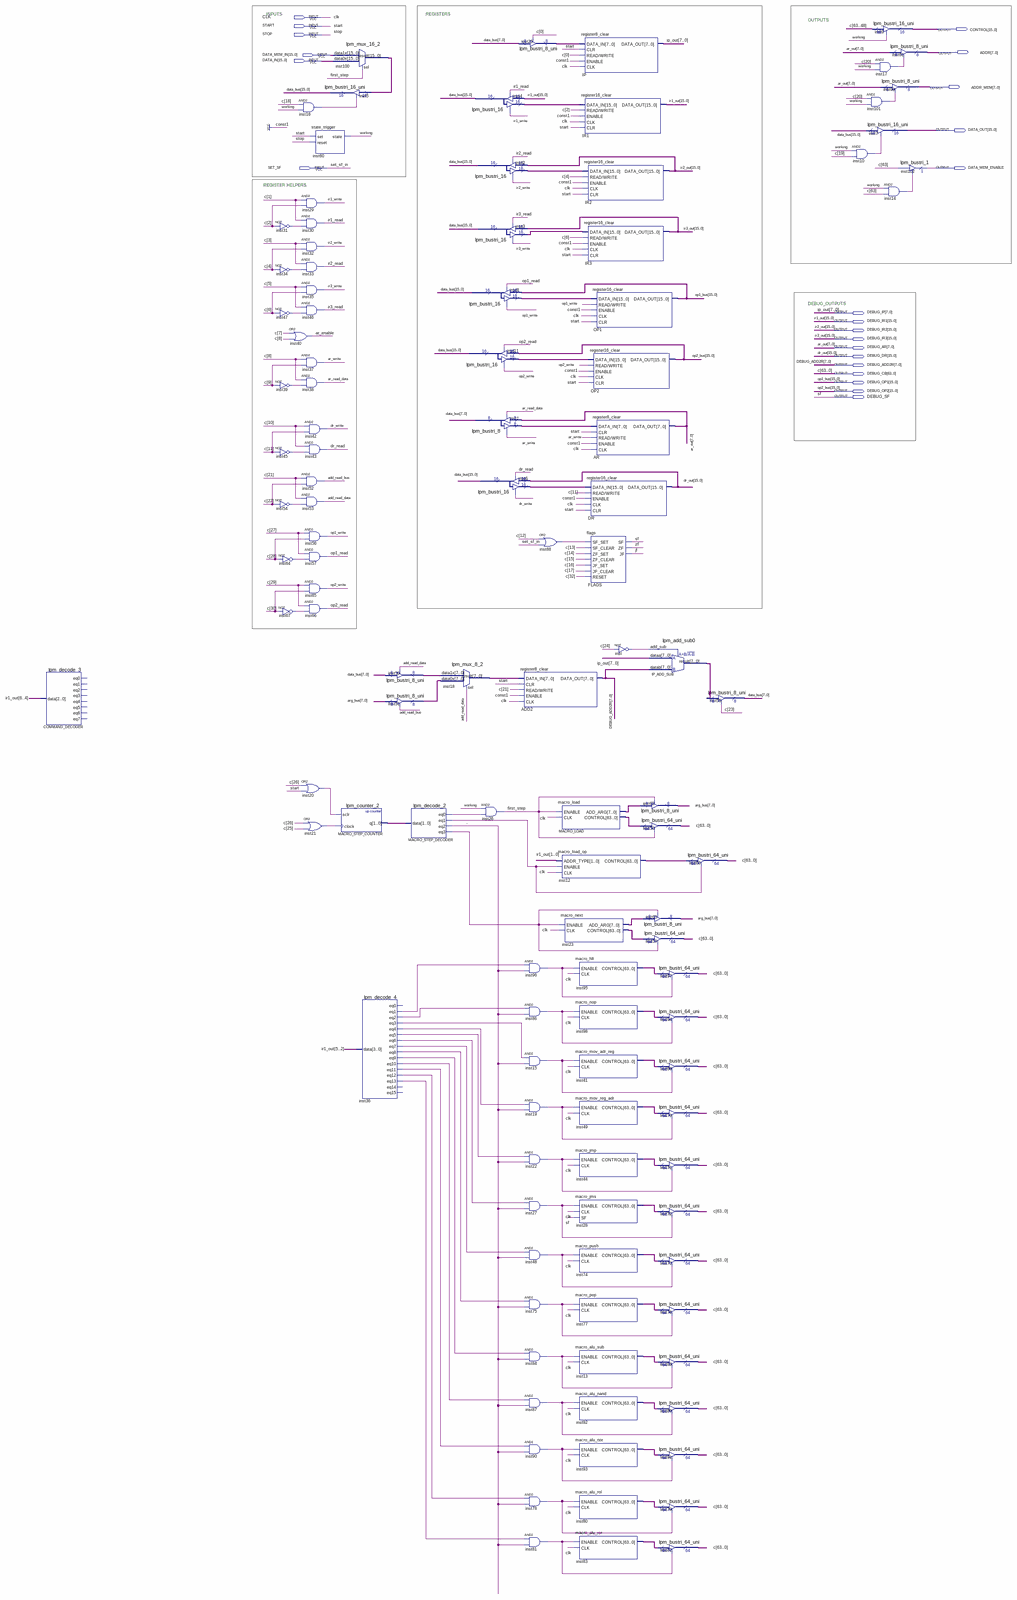
[diagram p0: schematic sheet, whole]
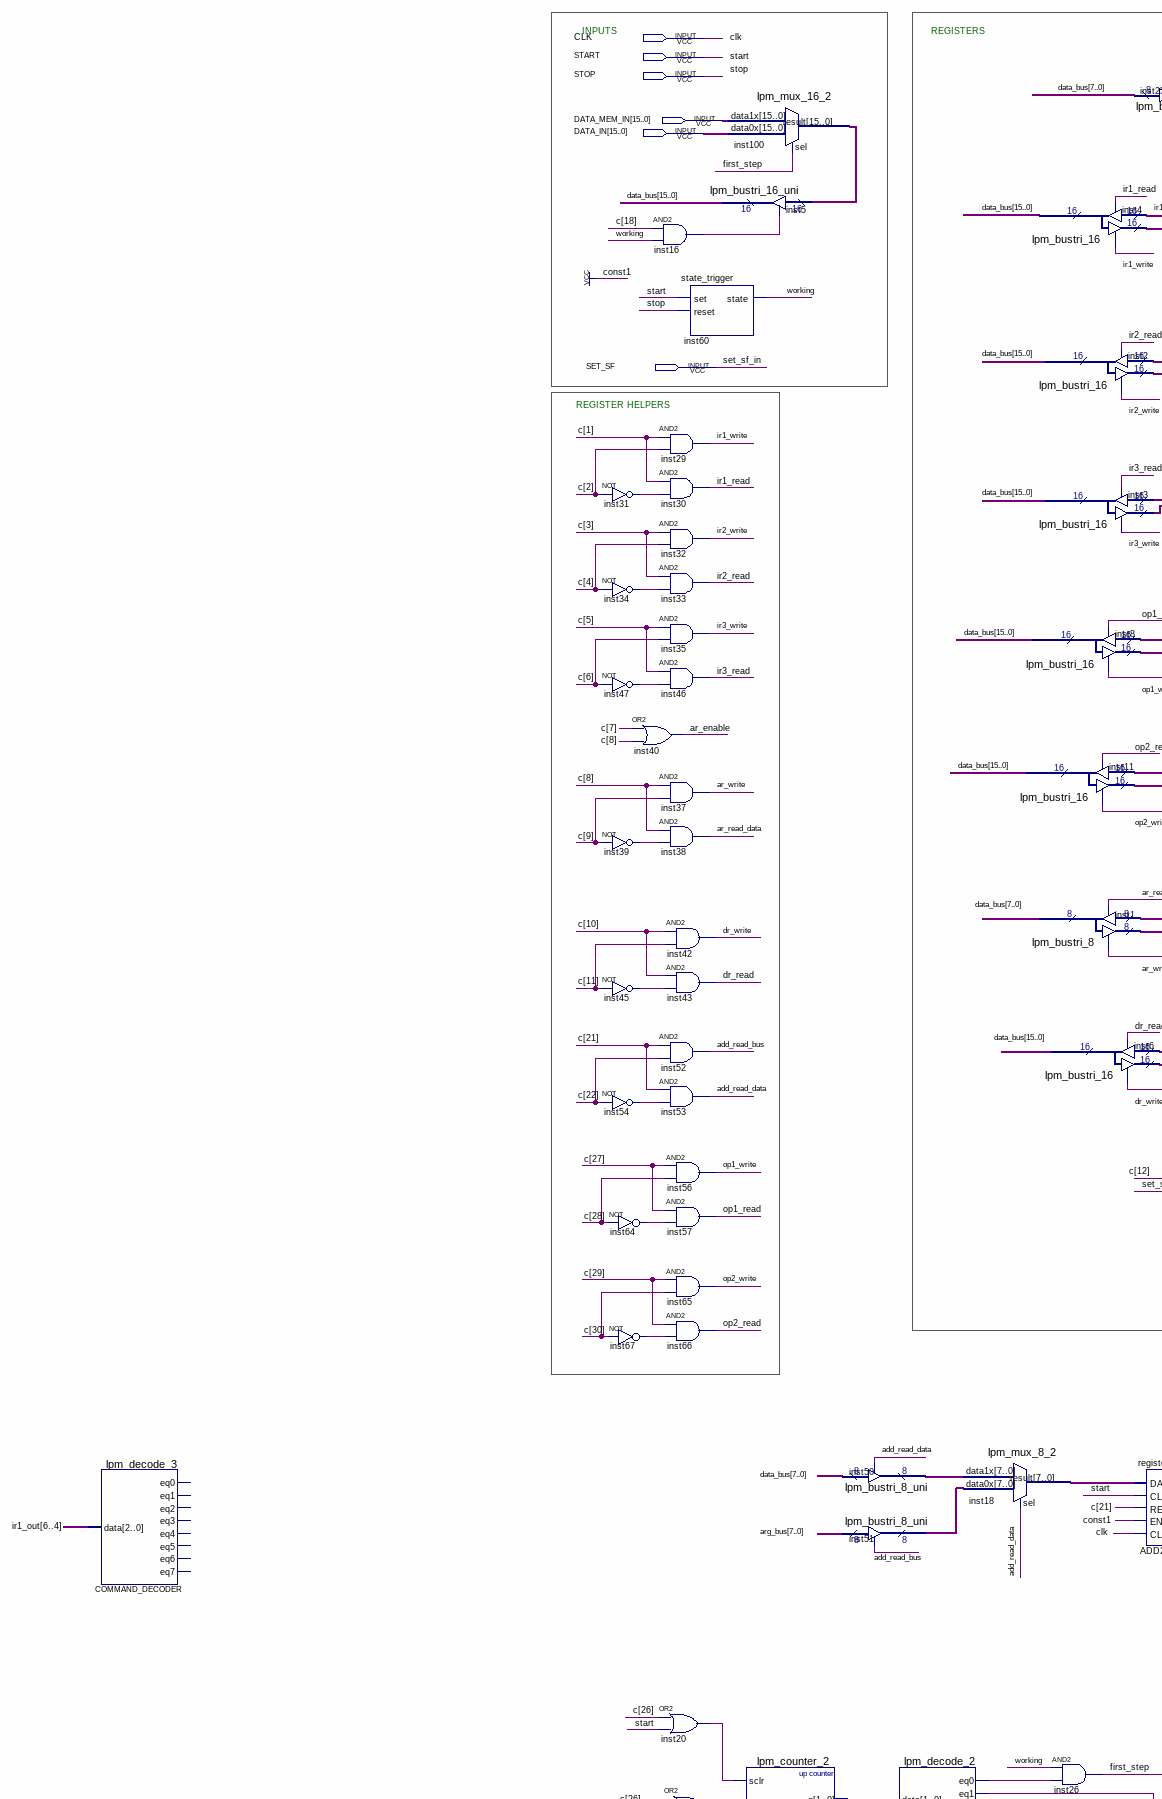
[diagram p1: schematic sheet, upper left part]
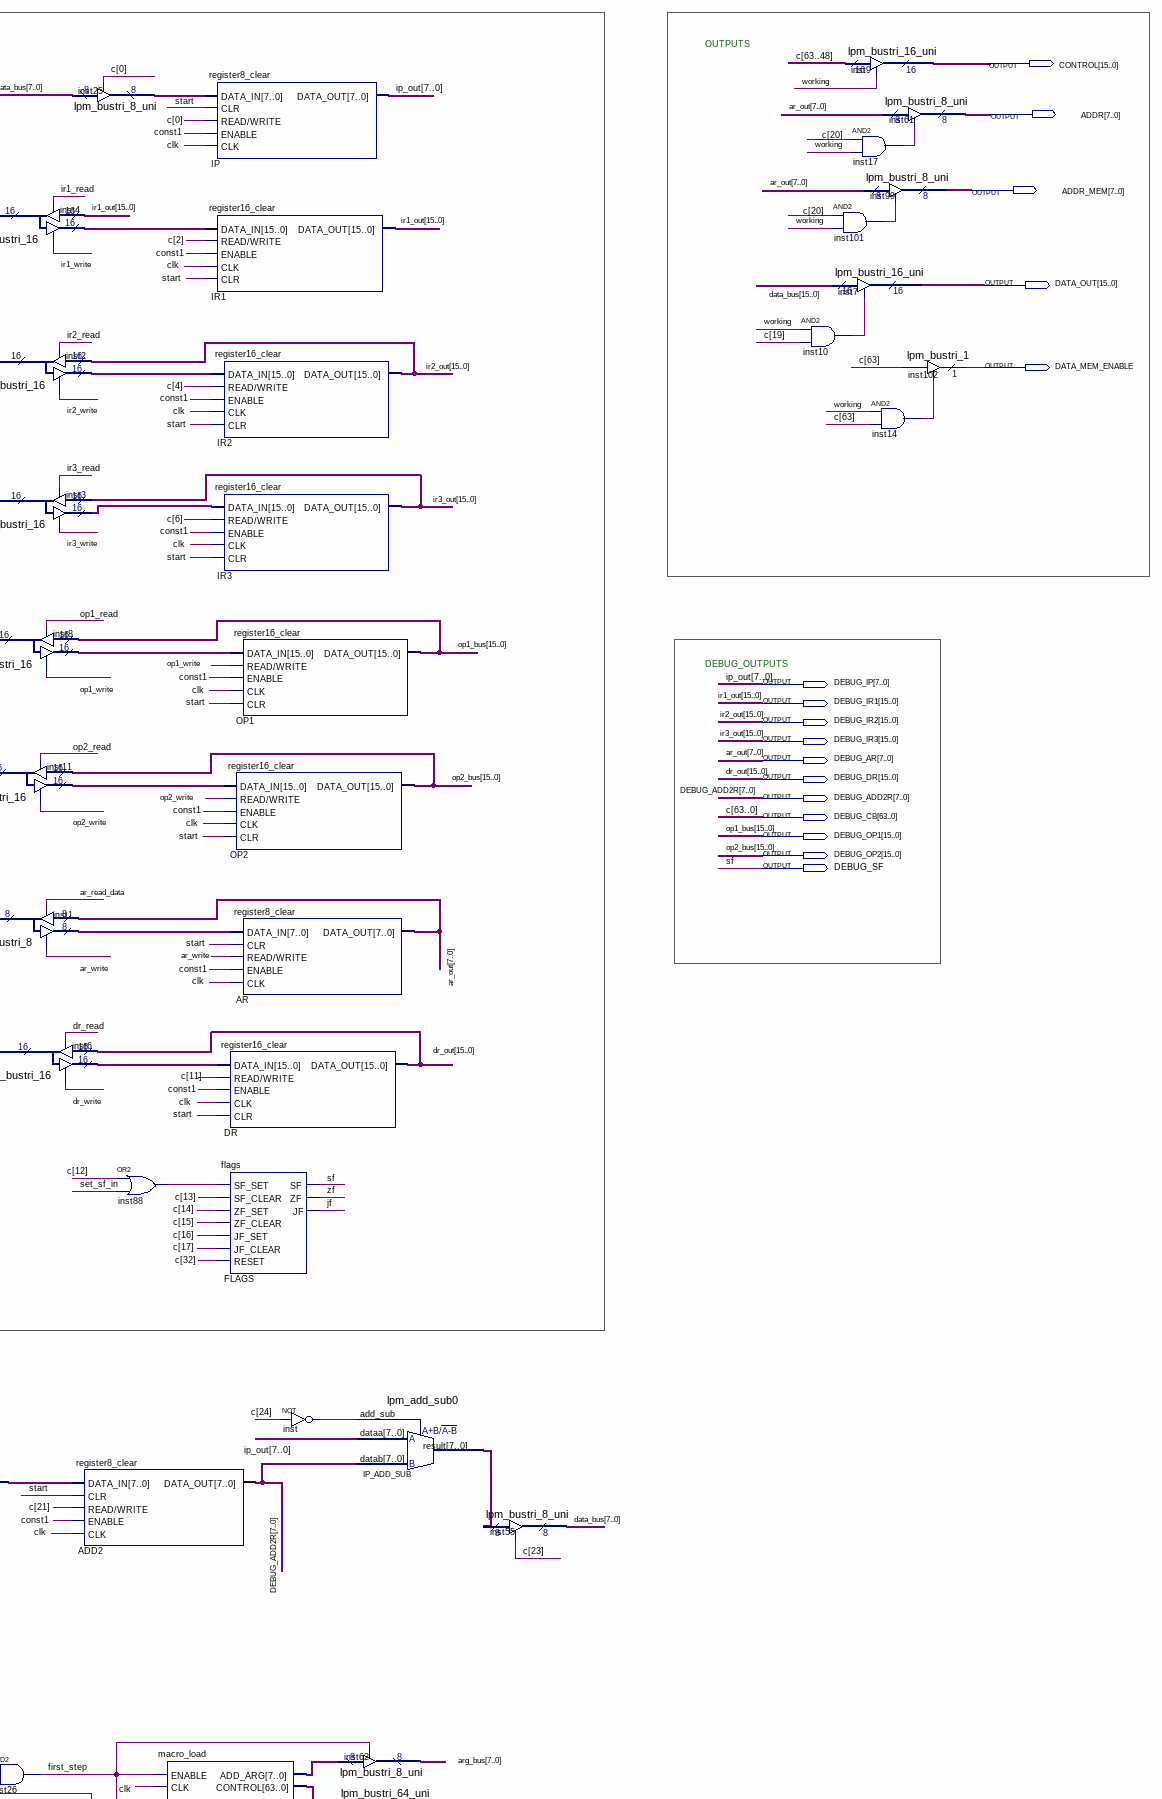
[diagram p2: schematic sheet, upper right part]
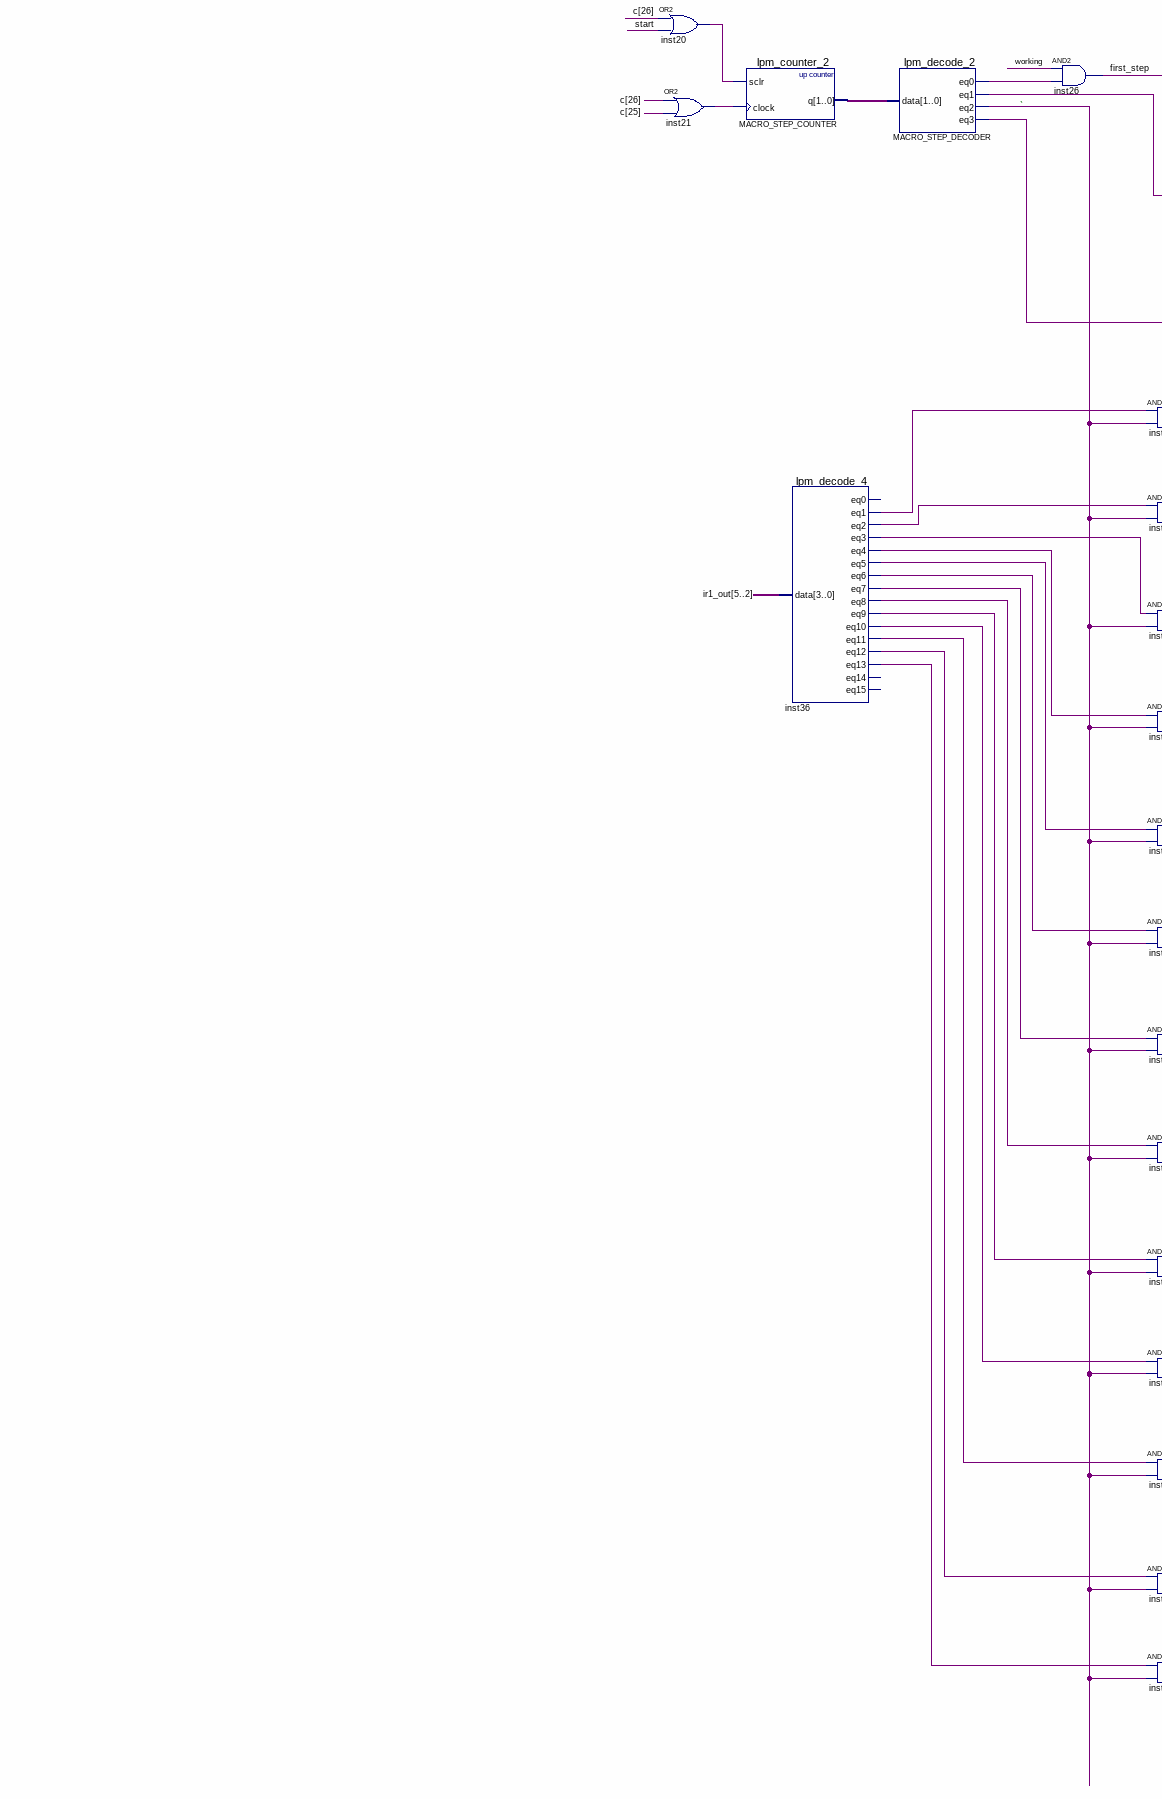
[diagram p3: schematic sheet, lower left part]
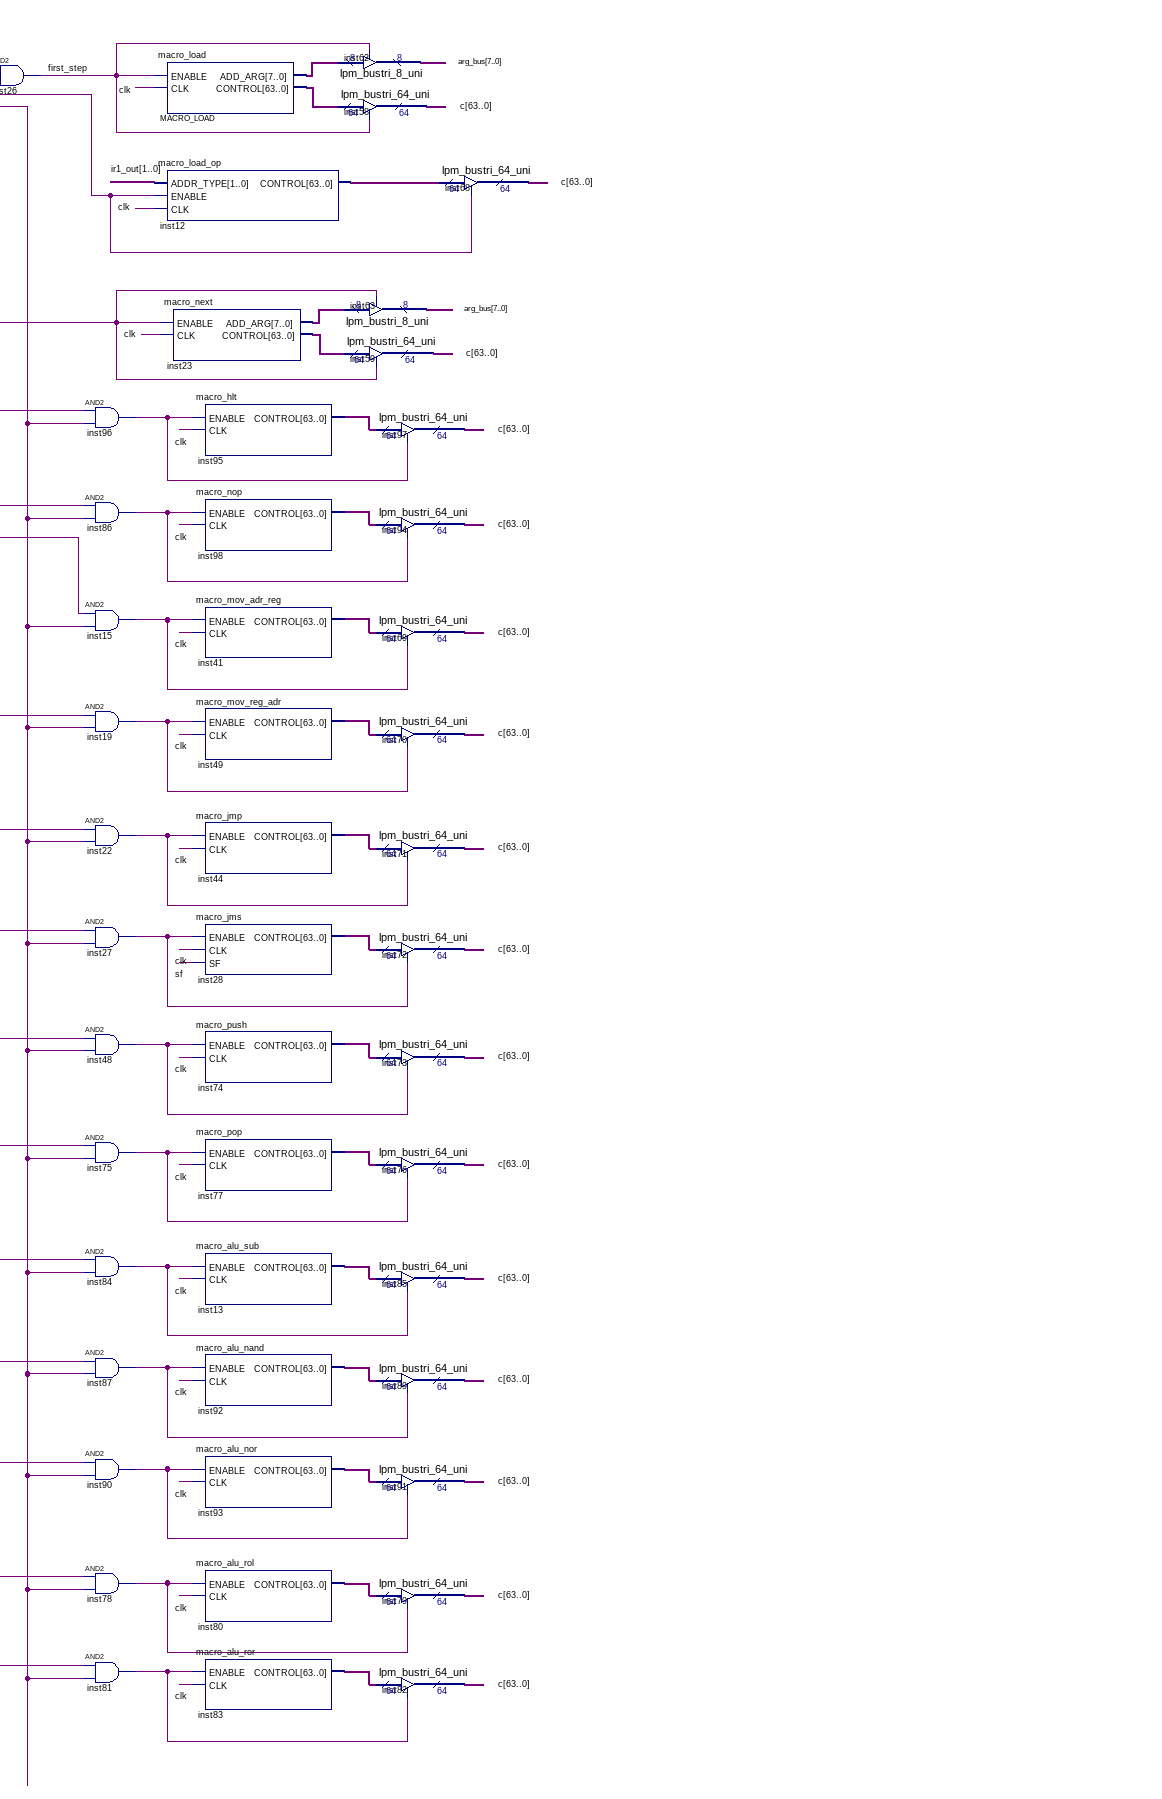
[diagram p4: schematic sheet, lower right part]
// Quartus schematic control_block.bdf as structural Verilog: 117 symbols, 22 pins
module control_block (
  input  CLK,
  input  START,
  input  STOP,
  input  [15:0] DATA_MEM_IN,
  input  [15:0] DATA_IN,
  input  SET_SF,
  output [15:0] CONTROL,
  output [7:0] ADDR,
  output [7:0] ADDR_MEM,
  output [15:0] DATA_OUT,
  output DATA_MEM_ENABLE,
  output [7:0] DEBUG_IP,
  output [15:0] DEBUG_IR1,
  output [15:0] DEBUG_IR2,
  output [15:0] DEBUG_IR3,
  output [7:0] DEBUG_AR,
  output [15:0] DEBUG_DR,
  output [7:0] DEBUG_ADD2R,
  output [63:0] DEBUG_CB,
  output [15:0] DEBUG_OP1,
  output [15:0] DEBUG_OP2,
  output DEBUG_SF
);

  wire add_read_bus, add_read_data, ar_enable, ar_read_data, ar_write, dr_read, dr_write, first_step,
       inst10_out, inst14_out, inst15_out, inst16_out, inst17_out, inst19_out, inst20_out, inst21_out,
       inst22_out, inst27_out, inst31_out, inst34_out, inst36_eq1, inst36_eq2, inst36_eq3, inst36_eq4,
       inst36_eq5, inst36_eq6, inst36_eq7, inst36_eq8, inst36_eq9, inst36_eq10, inst36_eq11, inst36_eq12,
       inst36_eq13, inst39_out, inst45_out, inst47_out, inst48_out, inst54_out, inst64_out, inst67_out,
       inst75_out, inst78_out, inst81_out, inst84_out, inst86_out, inst87_out, inst88_out, inst90_out,
       inst96_out, inst101_out, inst_out, ir1_read, ir1_write, ir2_read, ir2_write, ir3_read, ir3_write, jf,
       MACRO_STEP_DECODER_eq0, MACRO_STEP_DECODER_eq1, MACRO_STEP_DECODER_eq2, MACRO_STEP_DECODER_eq3,
       op1_read, op1_write, op2_read, op2_write, working, zf;
  wire [1:0] MACRO_STEP_COUNTER_q;
  wire [7:0] arg_bus, inst1_result, inst18_result, inst23_add_arg, inst25_tridata, inst50_tridata,
       inst51_tridata, IP_ADD_SUB_result, MACRO_LOAD_add_arg;
  wire [15:0] data_bus, inst2_result, inst3_result, inst4_result, inst6_result, inst8_result, inst11_result,
       inst100_result;
  wire [63:0] inst12_control, inst13_control, inst23_control, inst28_control, inst41_control, inst44_control,
       inst49_control, inst74_control, inst77_control, inst80_control, inst83_control, inst92_control,
       inst93_control, inst95_control, inst98_control, MACRO_LOAD_control;

  lpm_decode_3 COMMAND_DECODER (.data(DEBUG_IR1[6:4]));  // open: eq0, eq1, eq2, eq3, eq4, eq5, eq6, eq7
  not inst31 (inst31_out, DEBUG_CB[2]);
  not inst34 (inst34_out, DEBUG_CB[4]);
  not inst47 (inst47_out, DEBUG_CB[6]);
  or inst40 (ar_enable, DEBUG_CB[7], DEBUG_CB[8]);
  not inst39 (inst39_out, DEBUG_CB[9]);
  not inst45 (inst45_out, DEBUG_CB[11]);
  not inst54 (inst54_out, DEBUG_CB[22]);
  not inst64 (inst64_out, DEBUG_CB[28]);
  not inst67 (inst67_out, DEBUG_CB[30]);
  and inst16 (inst16_out, DEBUG_CB[18], working);
  state_trigger inst60 (.set(START), .reset(STOP), .state(working));
  and inst29 (ir1_write, DEBUG_CB[1], DEBUG_CB[2]);
  and inst30 (ir1_read, DEBUG_CB[1], inst31_out);
  and inst32 (ir2_write, DEBUG_CB[3], DEBUG_CB[4]);
  and inst33 (ir2_read, DEBUG_CB[3], inst34_out);
  and inst35 (ir3_write, DEBUG_CB[5], DEBUG_CB[6]);
  and inst46 (ir3_read, DEBUG_CB[5], inst47_out);
  and inst37 (ar_write, DEBUG_CB[8], DEBUG_CB[9]);
  and inst38 (ar_read_data, DEBUG_CB[8], inst39_out);
  and inst42 (dr_write, DEBUG_CB[10], DEBUG_CB[11]);
  and inst43 (dr_read, DEBUG_CB[10], inst45_out);
  and inst52 (add_read_bus, DEBUG_CB[21], DEBUG_CB[22]);
  and inst53 (add_read_data, DEBUG_CB[21], inst54_out);
  and inst56 (op1_write, DEBUG_CB[27], DEBUG_CB[28]);
  and inst57 (op1_read, DEBUG_CB[27], inst64_out);
  and inst65 (op2_write, DEBUG_CB[29], DEBUG_CB[30]);
  and inst66 (op2_read, DEBUG_CB[29], inst67_out);
  or inst20 (inst20_out, DEBUG_CB[26], START);
  or inst21 (inst21_out, DEBUG_CB[26], DEBUG_CB[25]);
  lpm_mux_16_2 inst100 (.data1x(DATA_MEM_IN), .data0x(DATA_IN), .sel(first_step), .result(inst100_result));
  lpm_bustri_16_uni inst5 (.enabledt(inst16_out), .data(inst100_result), .tridata(data_bus));
  lpm_counter_2 MACRO_STEP_COUNTER (.sclr(inst20_out), .clock(inst21_out), .q(MACRO_STEP_COUNTER_q));
  lpm_decode_4 inst36 (
    .data(DEBUG_IR1[5:2]), .eq1(inst36_eq1), .eq2(inst36_eq2), .eq3(inst36_eq3), .eq4(inst36_eq4),
    .eq5(inst36_eq5), .eq6(inst36_eq6), .eq7(inst36_eq7), .eq8(inst36_eq8), .eq9(inst36_eq9),
    .eq10(inst36_eq10), .eq11(inst36_eq11), .eq12(inst36_eq12), .eq13(inst36_eq13));  // open: eq0, eq14, eq15
  lpm_bustri_8_uni inst50 (.enabledt(add_read_data), .data(data_bus[7:0]), .tridata(inst50_tridata));
  lpm_bustri_8_uni inst51 (.enabledt(add_read_bus), .data(arg_bus), .tridata(inst51_tridata));
  lpm_decode_2 MACRO_STEP_DECODER (
    .data(MACRO_STEP_COUNTER_q), .eq0(MACRO_STEP_DECODER_eq0), .eq1(MACRO_STEP_DECODER_eq1),
    .eq2(MACRO_STEP_DECODER_eq2), .eq3(MACRO_STEP_DECODER_eq3));
  lpm_mux_8_2 inst18 (.data1x(inst50_tridata), .data0x(inst51_tridata), .sel(add_read_data), .result(inst18_result));
  lpm_bustri_16 inst4 (
    .enabledt(ir1_read), .data(DEBUG_IR1), .enabletr(ir1_write), .result(inst4_result), .tridata(data_bus));
  lpm_bustri_16 inst2 (
    .enabledt(ir2_read), .data(DEBUG_IR2), .enabletr(ir2_write), .result(inst2_result), .tridata(data_bus));
  lpm_bustri_16 inst3 (
    .enabledt(ir3_read), .data(DEBUG_IR3), .enabletr(ir3_write), .result(inst3_result), .tridata(data_bus));
  lpm_bustri_16 inst8 (
    .enabledt(op1_read), .data(DEBUG_OP1), .enabletr(op1_write), .result(inst8_result), .tridata(data_bus));
  lpm_bustri_16 inst11 (
    .enabledt(op2_read), .data(DEBUG_OP2), .enabletr(op2_write), .result(inst11_result), .tridata(data_bus));
  lpm_bustri_8 inst1 (
    .enabledt(ar_read_data), .data(DEBUG_AR), .enabletr(ar_write), .result(inst1_result),
    .tridata(data_bus[7:0]));
  lpm_bustri_16 inst6 (
    .enabledt(dr_read), .data(DEBUG_DR), .enabletr(dr_write), .result(inst6_result), .tridata(data_bus));
  and inst26 (first_step, working, MACRO_STEP_DECODER_eq0);
  lpm_bustri_8_uni inst25 (.enabledt(DEBUG_CB[0]), .data(data_bus[7:0]), .tridata(inst25_tridata));
  register8_clear ADD2 (
    .DATA_IN(inst18_result), .CLR(START), .\READ/WRITE (DEBUG_CB[21]), .ENABLE(1'b1), .CLK(CLK),
    .DATA_OUT(DEBUG_ADD2R));
  and inst96 (inst96_out, inst36_eq1, MACRO_STEP_DECODER_eq2);
  and inst86 (inst86_out, inst36_eq2, MACRO_STEP_DECODER_eq2);
  and inst15 (inst15_out, inst36_eq3, MACRO_STEP_DECODER_eq2);
  and inst19 (inst19_out, inst36_eq4, MACRO_STEP_DECODER_eq2);
  and inst22 (inst22_out, inst36_eq5, MACRO_STEP_DECODER_eq2);
  and inst27 (inst27_out, inst36_eq6, MACRO_STEP_DECODER_eq2);
  and inst48 (inst48_out, inst36_eq7, MACRO_STEP_DECODER_eq2);
  and inst75 (inst75_out, inst36_eq8, MACRO_STEP_DECODER_eq2);
  and inst84 (inst84_out, inst36_eq9, MACRO_STEP_DECODER_eq2);
  and inst87 (inst87_out, inst36_eq10, MACRO_STEP_DECODER_eq2);
  and inst90 (inst90_out, inst36_eq11, MACRO_STEP_DECODER_eq2);
  and inst78 (inst78_out, inst36_eq12, MACRO_STEP_DECODER_eq2);
  and inst81 (inst81_out, inst36_eq13, MACRO_STEP_DECODER_eq2);
  or inst88 (inst88_out, DEBUG_CB[12], SET_SF);
  macro_load MACRO_LOAD (.ENABLE(first_step), .CLK(CLK), .ADD_ARG(MACRO_LOAD_add_arg), .CONTROL(MACRO_LOAD_control));
  macro_load_op inst12 (
    .ADDR_TYPE(DEBUG_IR1[1:0]), .ENABLE(MACRO_STEP_DECODER_eq1), .CLK(CLK), .CONTROL(inst12_control));
  macro_next inst23 (.ENABLE(MACRO_STEP_DECODER_eq3), .CLK(CLK), .ADD_ARG(inst23_add_arg), .CONTROL(inst23_control));
  macro_hlt inst95 (.ENABLE(inst96_out), .CLK(CLK), .CONTROL(inst95_control));
  macro_nop inst98 (.ENABLE(inst86_out), .CLK(CLK), .CONTROL(inst98_control));
  macro_mov_adr_reg inst41 (.ENABLE(inst15_out), .CLK(CLK), .CONTROL(inst41_control));
  macro_mov_reg_adr inst49 (.ENABLE(inst19_out), .CLK(CLK), .CONTROL(inst49_control));
  macro_jmp inst44 (.ENABLE(inst22_out), .CLK(CLK), .CONTROL(inst44_control));
  macro_jms inst28 (.ENABLE(inst27_out), .CLK(CLK), .SF(DEBUG_SF), .CONTROL(inst28_control));
  macro_push inst74 (.ENABLE(inst48_out), .CLK(CLK), .CONTROL(inst74_control));
  macro_pop inst77 (.ENABLE(inst75_out), .CLK(CLK), .CONTROL(inst77_control));
  macro_alu_sub inst13 (.ENABLE(inst84_out), .CLK(CLK), .CONTROL(inst13_control));
  macro_alu_nand inst92 (.ENABLE(inst87_out), .CLK(CLK), .CONTROL(inst92_control));
  macro_alu_nor inst93 (.ENABLE(inst90_out), .CLK(CLK), .CONTROL(inst93_control));
  macro_alu_rol inst80 (.ENABLE(inst78_out), .CLK(CLK), .CONTROL(inst80_control));
  macro_alu_ror inst83 (.ENABLE(inst81_out), .CLK(CLK), .CONTROL(inst83_control));
  register8_clear IP (
    .DATA_IN(inst25_tridata), .CLR(START), .\READ/WRITE (DEBUG_CB[0]), .ENABLE(1'b1), .CLK(CLK),
    .DATA_OUT(DEBUG_IP));
  register16_clear IR1 (
    .DATA_IN(inst4_result), .\READ/WRITE (DEBUG_CB[2]), .ENABLE(1'b1), .CLK(CLK), .CLR(START),
    .DATA_OUT(DEBUG_IR1));
  register16_clear IR2 (
    .DATA_IN(inst2_result), .\READ/WRITE (DEBUG_CB[4]), .ENABLE(1'b1), .CLK(CLK), .CLR(START),
    .DATA_OUT(DEBUG_IR2));
  register16_clear IR3 (
    .DATA_IN(inst3_result), .\READ/WRITE (DEBUG_CB[6]), .ENABLE(1'b1), .CLK(CLK), .CLR(START),
    .DATA_OUT(DEBUG_IR3));
  register16_clear OP1 (
    .DATA_IN(inst8_result), .\READ/WRITE (op1_write), .ENABLE(1'b1), .CLK(CLK), .CLR(START),
    .DATA_OUT(DEBUG_OP1));
  register16_clear OP2 (
    .DATA_IN(inst11_result), .\READ/WRITE (op2_write), .ENABLE(1'b1), .CLK(CLK), .CLR(START),
    .DATA_OUT(DEBUG_OP2));
  register8_clear AR (
    .DATA_IN(inst1_result), .CLR(START), .\READ/WRITE (ar_write), .ENABLE(1'b1), .CLK(CLK),
    .DATA_OUT(DEBUG_AR));
  register16_clear DR (
    .DATA_IN(inst6_result), .\READ/WRITE (DEBUG_CB[11]), .ENABLE(1'b1), .CLK(CLK), .CLR(START),
    .DATA_OUT(DEBUG_DR));
  flags FLAGS (
    .SF_SET(inst88_out), .SF_CLEAR(DEBUG_CB[13]), .ZF_SET(DEBUG_CB[14]), .ZF_CLEAR(DEBUG_CB[15]),
    .JF_SET(DEBUG_CB[16]), .JF_CLEAR(DEBUG_CB[17]), .RESET(DEBUG_CB[32]), .SF(DEBUG_SF), .ZF(zf), .JF(jf));
  not inst (inst_out, DEBUG_CB[24]);
  lpm_bustri_8_uni inst62 (.enabledt(first_step), .data(MACRO_LOAD_add_arg), .tridata(arg_bus));
  lpm_bustri_64_uni inst58 (.enabledt(first_step), .data(MACRO_LOAD_control), .tridata(DEBUG_CB));
  lpm_bustri_8_uni inst63 (.enabledt(MACRO_STEP_DECODER_eq3), .data(inst23_add_arg), .tridata(arg_bus));
  lpm_bustri_64_uni inst59 (.enabledt(MACRO_STEP_DECODER_eq3), .data(inst23_control), .tridata(DEBUG_CB));
  lpm_add_sub0 IP_ADD_SUB (.dataa(DEBUG_IP), .datab(DEBUG_ADD2R), .add_sub(inst_out), .result(IP_ADD_SUB_result));
  lpm_bustri_64_uni inst97 (.enabledt(inst96_out), .data(inst95_control), .tridata(DEBUG_CB));
  lpm_bustri_64_uni inst94 (.enabledt(inst86_out), .data(inst98_control), .tridata(DEBUG_CB));
  lpm_bustri_64_uni inst69 (.enabledt(inst15_out), .data(inst41_control), .tridata(DEBUG_CB));
  lpm_bustri_64_uni inst70 (.enabledt(inst19_out), .data(inst49_control), .tridata(DEBUG_CB));
  lpm_bustri_64_uni inst71 (.enabledt(inst22_out), .data(inst44_control), .tridata(DEBUG_CB));
  lpm_bustri_64_uni inst72 (.enabledt(inst27_out), .data(inst28_control), .tridata(DEBUG_CB));
  lpm_bustri_64_uni inst73 (.enabledt(inst48_out), .data(inst74_control), .tridata(DEBUG_CB));
  lpm_bustri_64_uni inst76 (.enabledt(inst75_out), .data(inst77_control), .tridata(DEBUG_CB));
  lpm_bustri_64_uni inst85 (.enabledt(inst84_out), .data(inst13_control), .tridata(DEBUG_CB));
  lpm_bustri_64_uni inst89 (.enabledt(inst87_out), .data(inst92_control), .tridata(DEBUG_CB));
  lpm_bustri_64_uni inst91 (.enabledt(inst90_out), .data(inst93_control), .tridata(DEBUG_CB));
  lpm_bustri_64_uni inst79 (.enabledt(inst78_out), .data(inst80_control), .tridata(DEBUG_CB));
  lpm_bustri_64_uni inst82 (.enabledt(inst81_out), .data(inst83_control), .tridata(DEBUG_CB));
  lpm_bustri_64_uni inst68 (.enabledt(MACRO_STEP_DECODER_eq1), .data(inst12_control), .tridata(DEBUG_CB));
  lpm_bustri_8_uni inst55 (.enabledt(DEBUG_CB[23]), .data(IP_ADD_SUB_result), .tridata(data_bus[7:0]));
  and inst10 (inst10_out, working, DEBUG_CB[19]);
  lpm_bustri_16_uni inst9 (.enabledt(working), .data(DEBUG_CB[63:48]), .tridata(CONTROL));
  and inst17 (inst17_out, DEBUG_CB[20], working);
  and inst101 (inst101_out, DEBUG_CB[20], working);
  lpm_bustri_16_uni inst7 (.enabledt(inst10_out), .data(data_bus), .tridata(DATA_OUT));
  lpm_bustri_8_uni inst61 (.enabledt(inst17_out), .data(DEBUG_AR), .tridata(ADDR));
  lpm_bustri_8_uni inst99 (.enabledt(inst101_out), .data(DEBUG_AR), .tridata(ADDR_MEM));
  lpm_bustri_1 inst102 (.enabledt(inst14_out), .data(DEBUG_CB[63]), .tridata(DATA_MEM_ENABLE));
  and inst14 (inst14_out, working, DEBUG_CB[63]);

  // Other names for the same wires on the sheet: ar_out[7:0] = DEBUG_AR; c[63:0] = DEBUG_CB; dr_out[15:0] = DEBUG_DR;
  //   ip_out[7:0] = DEBUG_IP; ir1_out[15:0] = DEBUG_IR1; ir2_out[15:0] = DEBUG_IR2; ir3_out[15:0] = DEBUG_IR3;
  //   op1_bus[15:0] = DEBUG_OP1; op2_bus[15:0] = DEBUG_OP2; set_sf_in = SET_SF; sf = DEBUG_SF

  // Notes on the sheet:
  //   INPUTS
  //   REGISTERS
  //   OUTPUTS
  //   REGISTER HELPERS
  //   DEBUG_OUTPUTS
  //   `
endmodule
